# Altium schematic sheet LED_BUFFER_v1.SchDoc
size A1
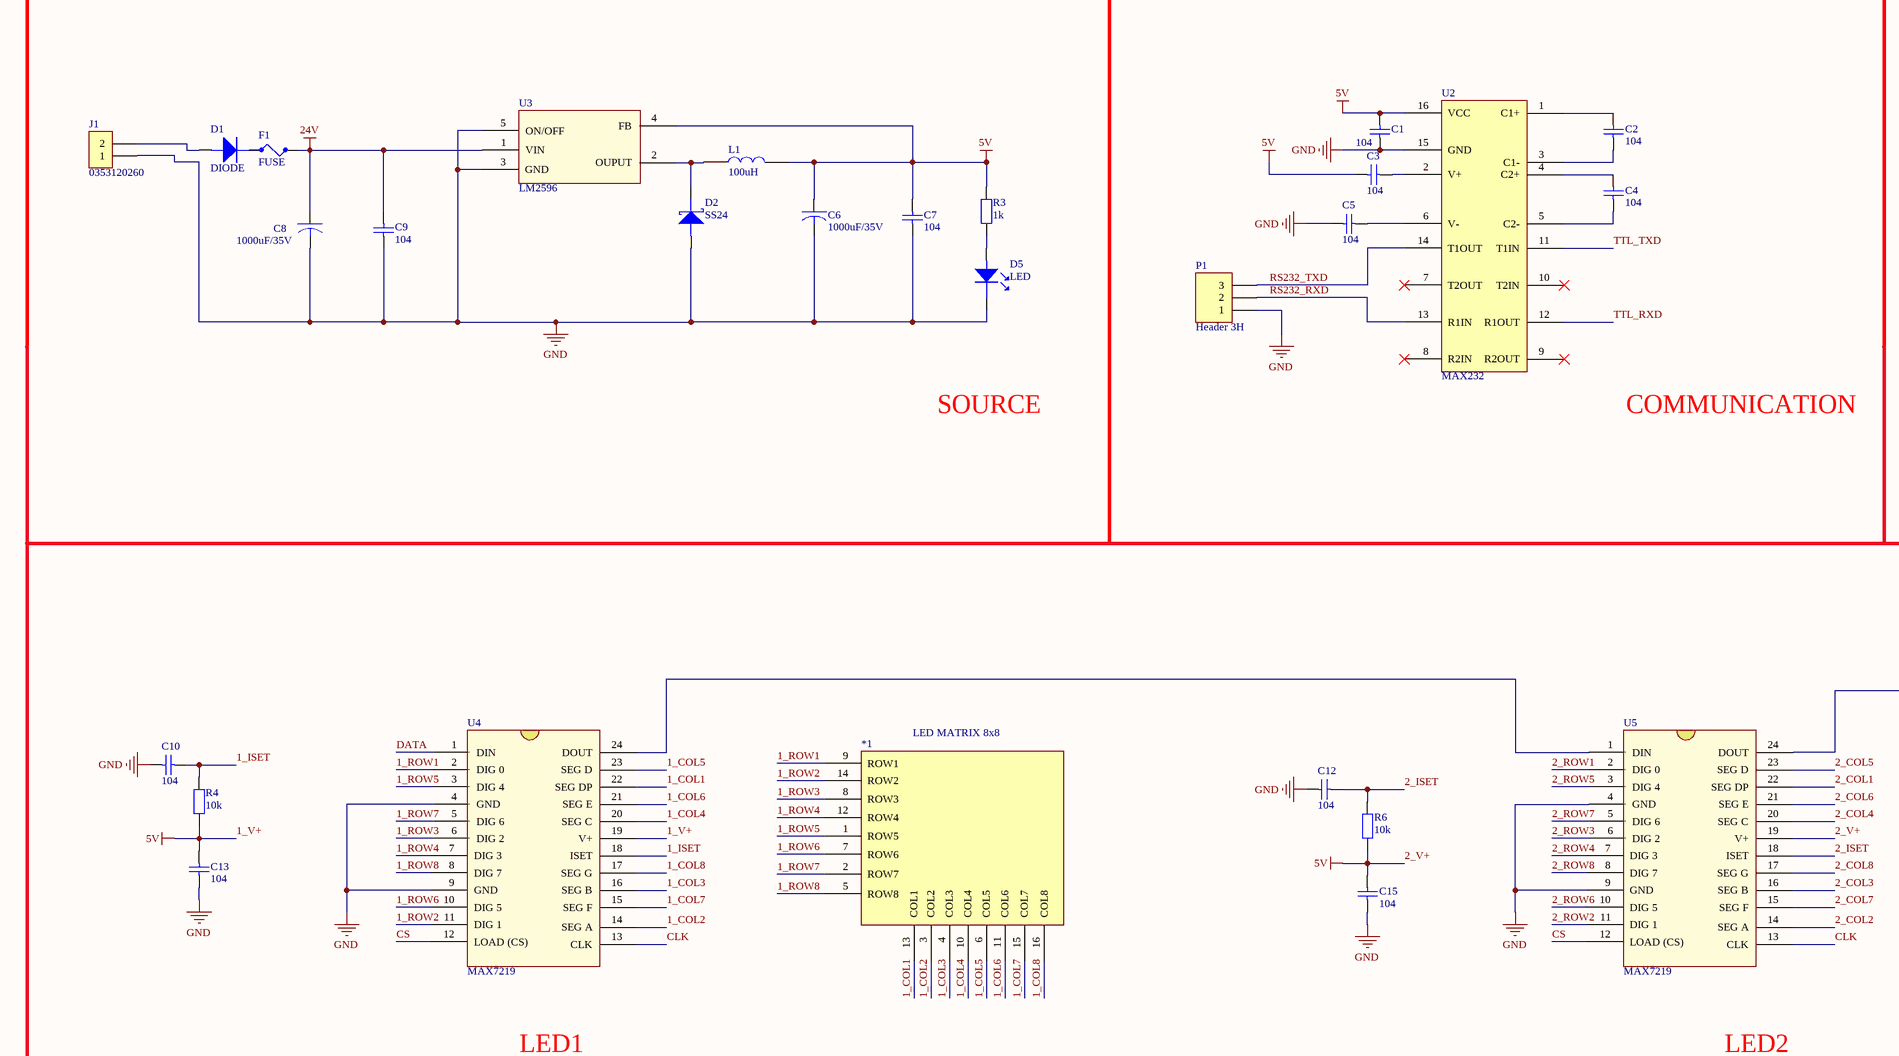
[diagram p0: LED_BUFFER_v1.SchDoc, top left]
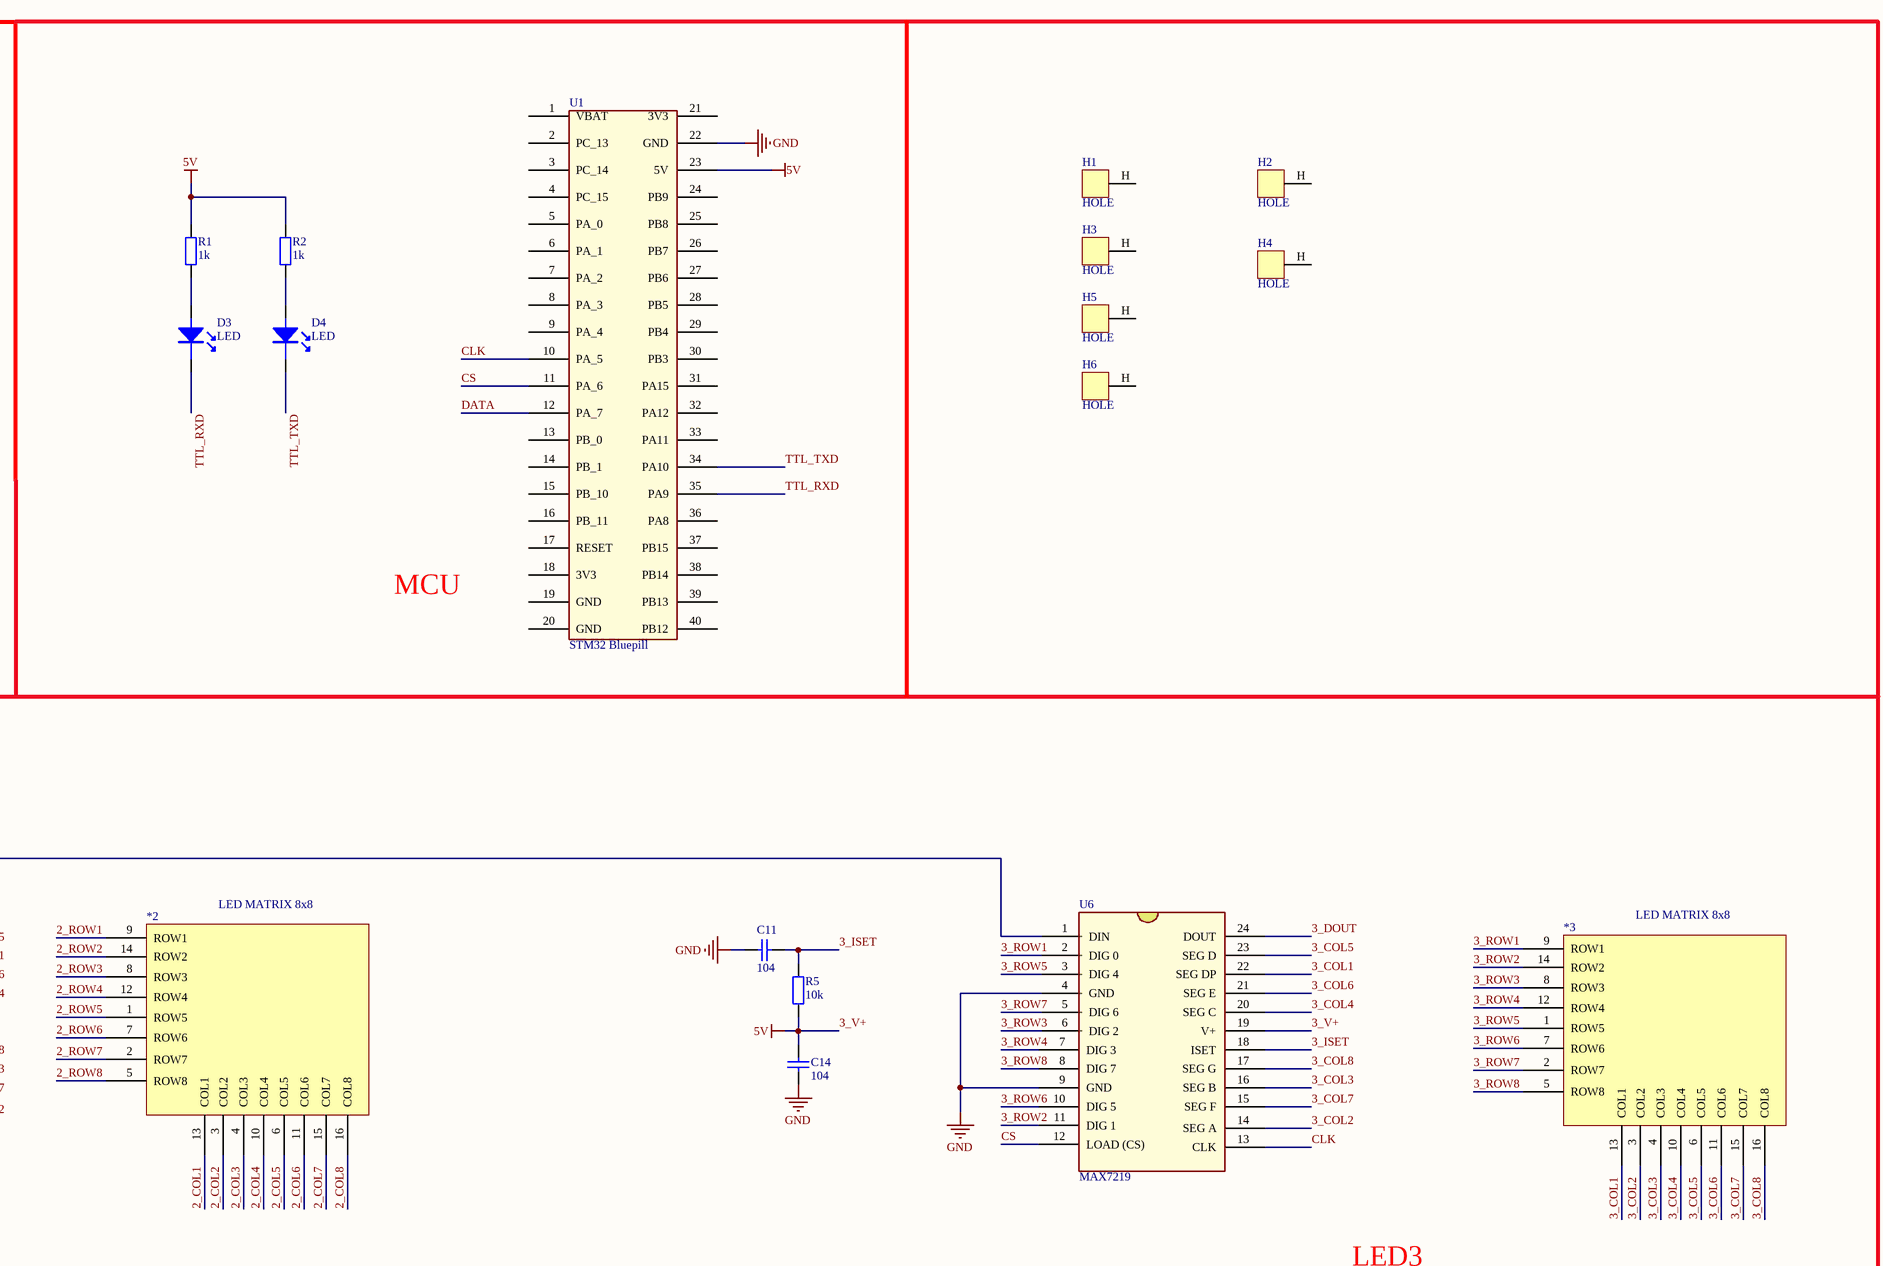
[diagram p1: LED_BUFFER_v1.SchDoc, top right]
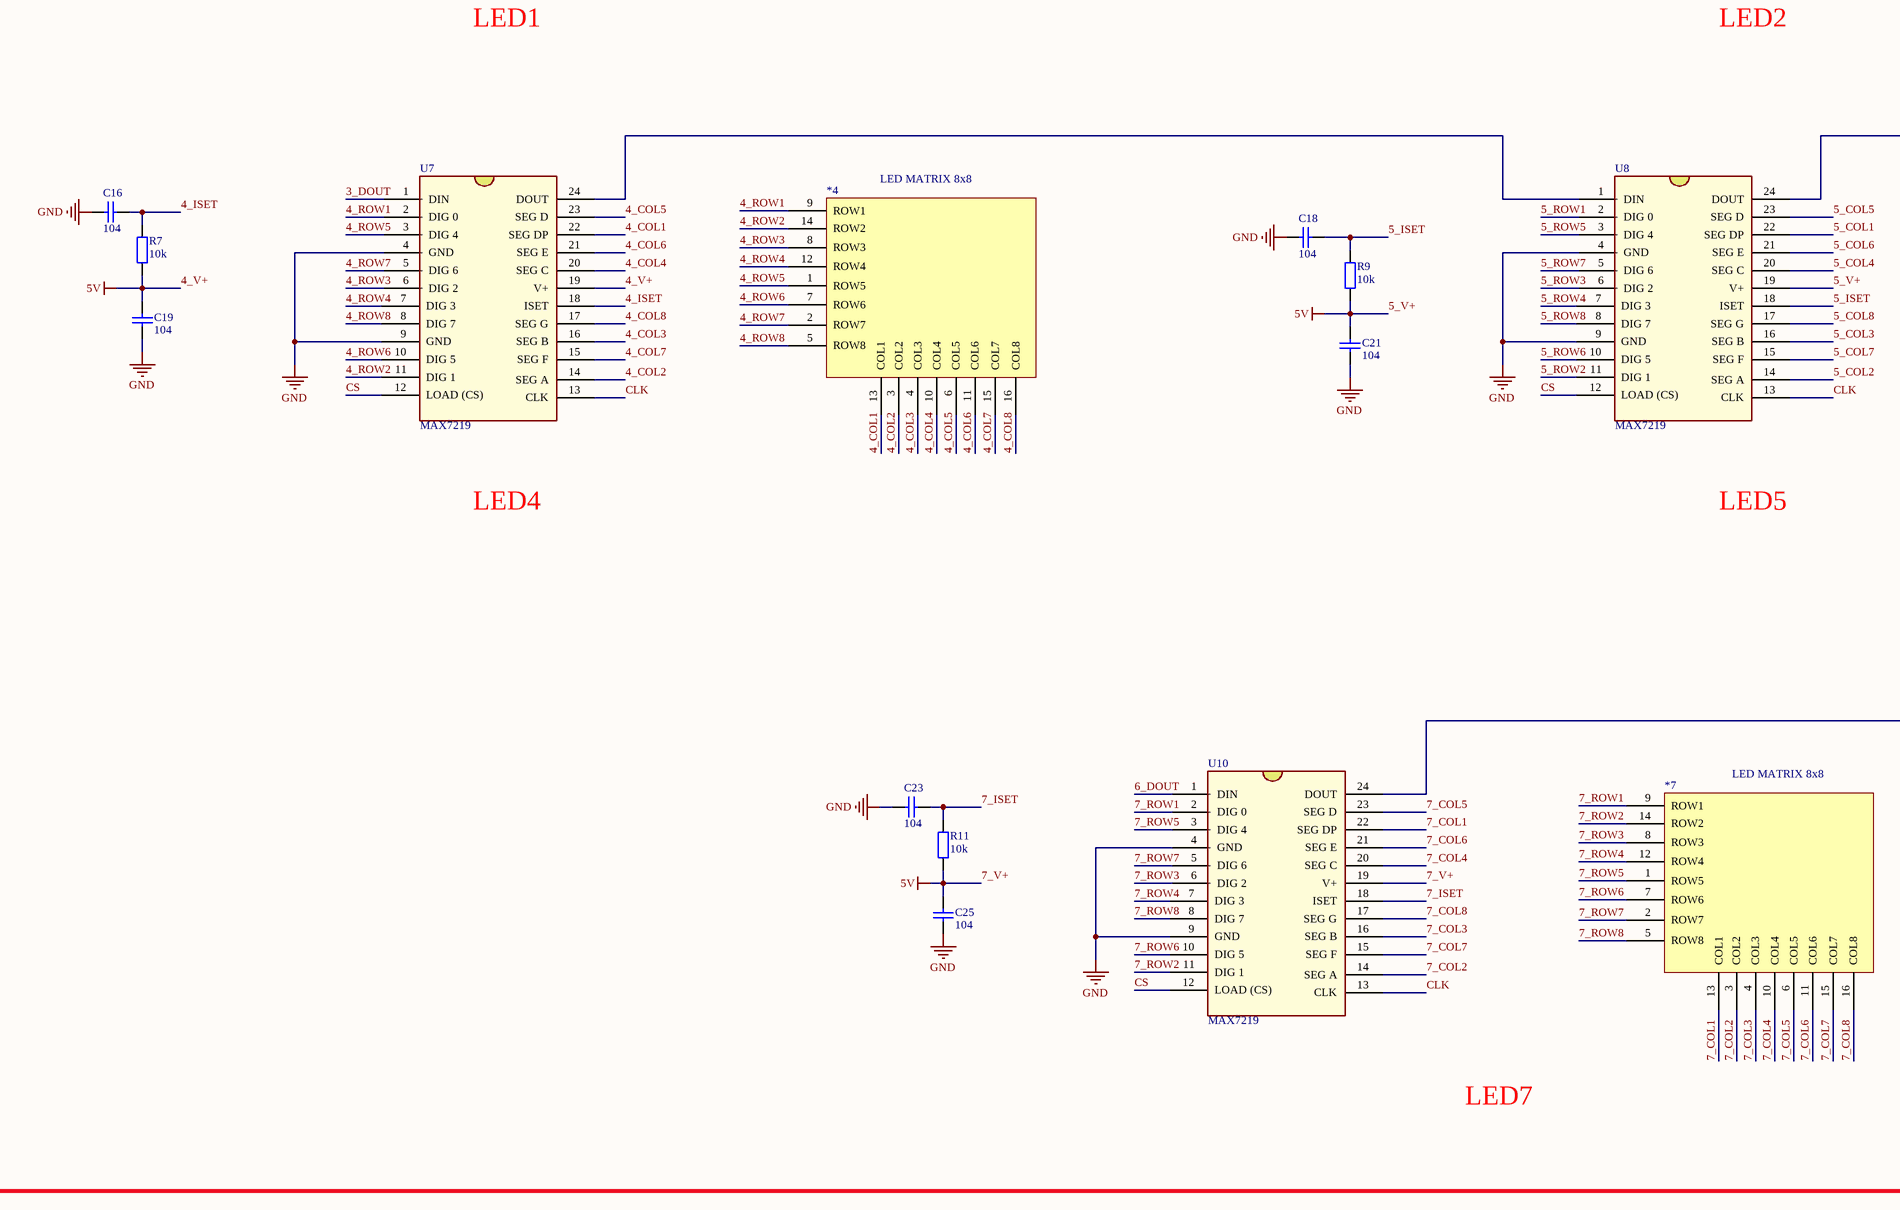
[diagram p2: LED_BUFFER_v1.SchDoc, bottom left]
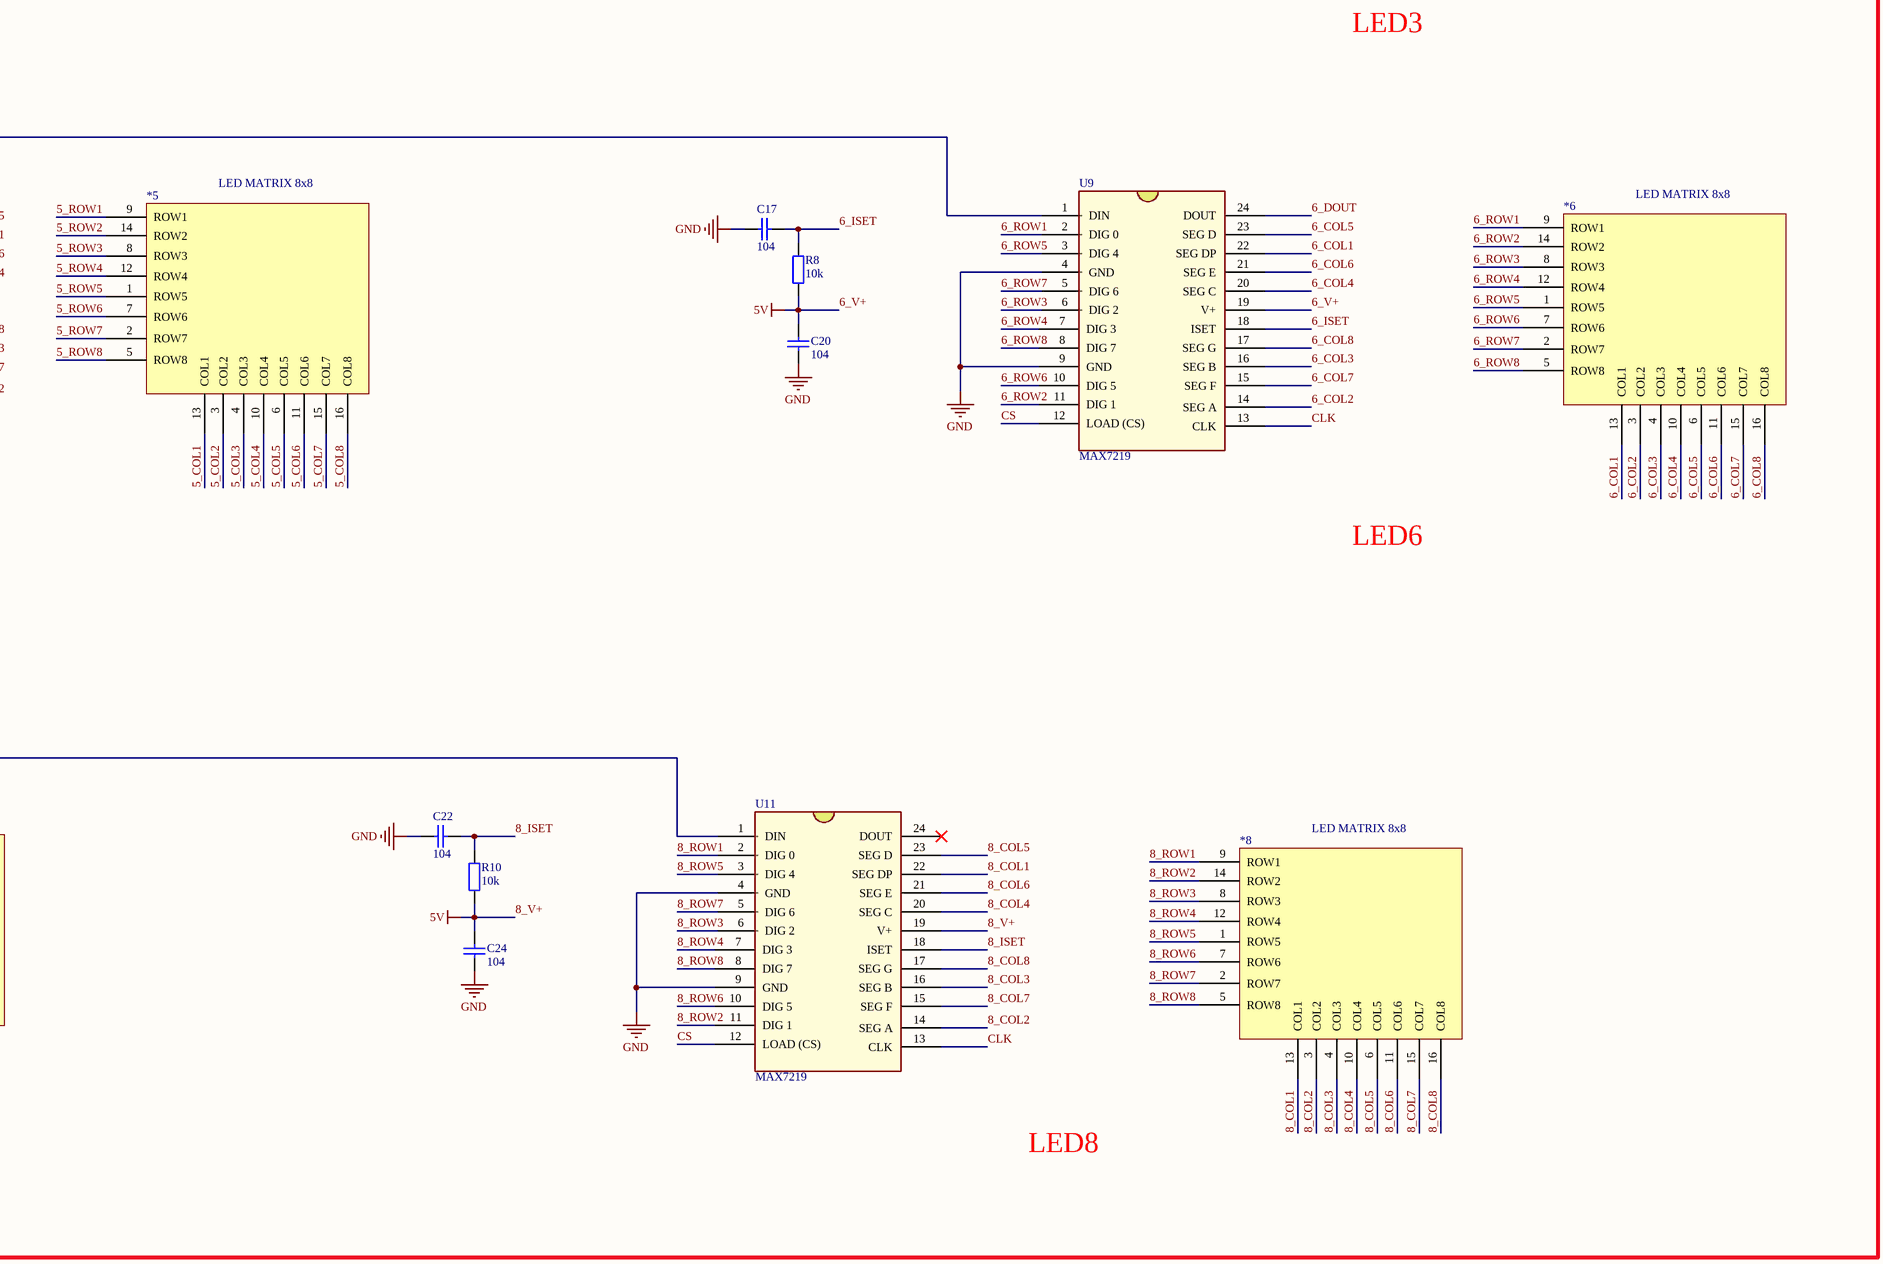
[diagram p3: LED_BUFFER_v1.SchDoc, bottom right]

## Parts
*1  LED MATRIX 8x8  [LED MATRIX 8x8]
*2  LED MATRIX 8x8  [LED MATRIX 8x8]
*3  LED MATRIX 8x8  [LED MATRIX 8x8]
*4  LED MATRIX 8x8  [LED MATRIX 8x8]
*5  LED MATRIX 8x8  [LED MATRIX 8x8]
*6  LED MATRIX 8x8  [LED MATRIX 8x8]
*7  LED MATRIX 8x8  [LED MATRIX 8x8]
*8  LED MATRIX 8x8  [LED MATRIX 8x8]
C1  104  [0805 CAP]
C2  104  [0805 CAP]
C3  104  [0805 CAP]
C4  104  [0805 CAP]
C5  104  [0805 CAP]
C6  1000uF/35V  [CAP ALUMINUM SMD]
C7  104  [0805 CAP]
C8  1000uF/35V  [CAP ALUMINUM SMD]
C9  104  [0805 CAP]
C10  104  [0805 CAP]
C11  104  [0805 CAP]
C12  104  [0805 CAP]
C13  104  [0805 CAP]
C14  104  [0805 CAP]
C15  104  [0805 CAP]
C16  104  [0805 CAP]
C17  104  [0805 CAP]
C18  104  [0805 CAP]
C19  104  [0805 CAP]
C20  104  [0805 CAP]
C21  104  [0805 CAP]
C22  104  [0805 CAP]
C23  104  [0805 CAP]
C24  104  [0805 CAP]
C25  104  [0805 CAP]
D1  DIODE  [DIODE SMA]
D2  SS24  [DIODE ZENER SMD]
D3  LED  [LED SMD 0805]
D4  LED  [LED SMD 0805]
D5  LED  [LED SMD 0805]
F1  FUSE  [FUSE 1812]
H1  HOLE  [HOLE]
H2  HOLE  [HOLE]
H3  HOLE  [HOLE]
H4  HOLE  [HOLE]
H5  HOLE  [HOLE]
H6  HOLE  [HOLE]
J1  CONN HEADER VERT 2POS 2.5MM  [0353120260]  (value not drawn)
L1  100uH  [CDRH127 - 3A]
P1  Header 3H  [HDR1X3 2mm]
R1  1k  [0805 RESISTOR]
R2  1k  [0805 RESISTOR]
R3  1k  [0805 RESISTOR]
R4  10k  [0805 RESISTOR]
R5  10k  [0805 RESISTOR]
R6  10k  [0805 RESISTOR]
R7  10k  [0805 RESISTOR]
R8  10k  [0805 RESISTOR]
R9  10k  [0805 RESISTOR]
R10  10k  [0805 RESISTOR]
R11  10k  [0805 RESISTOR]
U1  STM32 Bluepill  [Arduino STM32F103]
U2  MAX232  [SOIC 16PIN]
U3  LM2596  [TO263-5]
U4  MAX7219  [SOIC127P1030X265-24N]
U5  MAX7219  [SOIC127P1030X265-24N]
U6  MAX7219  [SOIC127P1030X265-24N]
U7  MAX7219  [SOIC127P1030X265-24N]
U8  MAX7219  [SOIC127P1030X265-24N]
U9  MAX7219  [SOIC127P1030X265-24N]
U10  MAX7219  [SOIC127P1030X265-24N]
U11  MAX7219  [SOIC127P1030X265-24N]

## Nets
1_V+: C1.2 C3.1 C6.1 C7.1 C13.1 C14.1 C15.1 C19.1 C20.1 C21.1 C24.1 C25.1 L1.2 R1.2 R2.2 R3.2 R4.1 R5.1 R6.1 R7.1 R8.1 R9.1 R10.1 R11.1 U1.23(5V) U2.16(VCC) U3.4(FB) U4.19(V+) U5.19(V+) U6.19(V+) U7.19(V+) U8.19(V+) U9.19(V+) U10.19(V+) U11.19(V+)  [also labelled 2_V+, 3_V+, 4_V+, 5_V+, 5V, 6_V+, 7_V+, 8_V+]
24V: C8.1 C9.1 F1.1 U3.1(VIN)
GND: C1.1 C5.1 C6.2 C7.2 C8.2 C9.2 C10.1 C11.1 C12.1 C13.2 C14.2 C15.2 C16.1 C17.1 C18.1 C19.2 C20.2 C21.2 C22.1 C23.1 C24.2 C25.2 D2.1(A) D5.2 J1.1 P1.1 U1.22(GND) U2.15(GND) U3.3(GND) U3.5(ON/OFF) U4.4(GND) U4.9(GND) U5.4(GND) U5.9(GND) U6.4(GND) U6.9(GND) U7.4(GND) U7.9(GND) U8.4(GND) U8.9(GND) U9.4(GND) U9.9(GND) U10.4(GND) U10.9(GND) U11.4(GND) U11.9(GND)
1_COL1: *1.13(COL1) U4.22(SEG_DP)
1_COL2: *1.3(COL2) U4.14(SEG_A)
1_COL3: *1.4(COL3) U4.16(SEG_B)
1_COL4: *1.10(COL4) U4.20(SEG_C)
1_COL5: *1.6(COL5) U4.23(SEG_D)
1_COL6: *1.11(COL6) U4.21(SEG_E)
1_COL7: *1.15(COL7) U4.15(SEG_F)
1_COL8: *1.16(COL8) U4.17(SEG_G)
1_ISET: C10.2 R4.2 U4.18(ISET)
1_ROW1: *1.9(ROW1) U4.2(DIG_0)
1_ROW2: *1.14(ROW2) U4.11(DIG_1)
1_ROW3: *1.8(ROW3) U4.6(DIG_2)
1_ROW4: *1.12(ROW4) U4.7(DIG_3)
1_ROW5: *1.1(ROW5) U4.3(DIG_4)
1_ROW6: *1.7(ROW6) U4.10(DIG_5)
1_ROW7: *1.2(ROW7) U4.5(DIG_6)
1_ROW8: *1.5(ROW8) U4.8(DIG_7)
2_COL1: *2.13(COL1) U5.22(SEG_DP)
2_COL2: *2.3(COL2) U5.14(SEG_A)
2_COL3: *2.4(COL3) U5.16(SEG_B)
2_COL4: *2.10(COL4) U5.20(SEG_C)
2_COL5: *2.6(COL5) U5.23(SEG_D)
2_COL6: *2.11(COL6) U5.21(SEG_E)
2_COL7: *2.15(COL7) U5.15(SEG_F)
2_COL8: *2.16(COL8) U5.17(SEG_G)
2_ISET: C12.2 R6.2 U5.18(ISET)
2_ROW1: *2.9(ROW1) U5.2(DIG_0)
2_ROW2: *2.14(ROW2) U5.11(DIG_1)
2_ROW3: *2.8(ROW3) U5.6(DIG_2)
2_ROW4: *2.12(ROW4) U5.7(DIG_3)
2_ROW5: *2.1(ROW5) U5.3(DIG_4)
2_ROW6: *2.7(ROW6) U5.10(DIG_5)
2_ROW7: *2.2(ROW7) U5.5(DIG_6)
2_ROW8: *2.5(ROW8) U5.8(DIG_7)
3_COL1: *3.13(COL1) U6.22(SEG_DP)
3_COL2: *3.3(COL2) U6.14(SEG_A)
3_COL3: *3.4(COL3) U6.16(SEG_B)
3_COL4: *3.10(COL4) U6.20(SEG_C)
3_COL5: *3.6(COL5) U6.23(SEG_D)
3_COL6: *3.11(COL6) U6.21(SEG_E)
3_COL7: *3.15(COL7) U6.15(SEG_F)
3_COL8: *3.16(COL8) U6.17(SEG_G)
3_DOUT: U6.24(DOUT) U7.1(DIN)
3_ISET: C11.2 R5.2 U6.18(ISET)
3_ROW1: *3.9(ROW1) U6.2(DIG_0)
3_ROW2: *3.14(ROW2) U6.11(DIG_1)
3_ROW3: *3.8(ROW3) U6.6(DIG_2)
3_ROW4: *3.12(ROW4) U6.7(DIG_3)
3_ROW5: *3.1(ROW5) U6.3(DIG_4)
3_ROW6: *3.7(ROW6) U6.10(DIG_5)
3_ROW7: *3.2(ROW7) U6.5(DIG_6)
3_ROW8: *3.5(ROW8) U6.8(DIG_7)
4_COL1: *4.13(COL1) U7.22(SEG_DP)
4_COL2: *4.3(COL2) U7.14(SEG_A)
4_COL3: *4.4(COL3) U7.16(SEG_B)
4_COL4: *4.10(COL4) U7.20(SEG_C)
4_COL5: *4.6(COL5) U7.23(SEG_D)
4_COL6: *4.11(COL6) U7.21(SEG_E)
4_COL7: *4.15(COL7) U7.15(SEG_F)
4_COL8: *4.16(COL8) U7.17(SEG_G)
4_ISET: C16.2 R7.2 U7.18(ISET)
4_ROW1: *4.9(ROW1) U7.2(DIG_0)
4_ROW2: *4.14(ROW2) U7.11(DIG_1)
4_ROW3: *4.8(ROW3) U7.6(DIG_2)
4_ROW4: *4.12(ROW4) U7.7(DIG_3)
4_ROW5: *4.1(ROW5) U7.3(DIG_4)
4_ROW6: *4.7(ROW6) U7.10(DIG_5)
4_ROW7: *4.2(ROW7) U7.5(DIG_6)
4_ROW8: *4.5(ROW8) U7.8(DIG_7)
5_COL1: *5.13(COL1) U8.22(SEG_DP)
5_COL2: *5.3(COL2) U8.14(SEG_A)
5_COL3: *5.4(COL3) U8.16(SEG_B)
5_COL4: *5.10(COL4) U8.20(SEG_C)
5_COL5: *5.6(COL5) U8.23(SEG_D)
5_COL6: *5.11(COL6) U8.21(SEG_E)
5_COL7: *5.15(COL7) U8.15(SEG_F)
5_COL8: *5.16(COL8) U8.17(SEG_G)
5_ISET: C18.2 R9.2 U8.18(ISET)
5_ROW1: *5.9(ROW1) U8.2(DIG_0)
5_ROW2: *5.14(ROW2) U8.11(DIG_1)
5_ROW3: *5.8(ROW3) U8.6(DIG_2)
5_ROW4: *5.12(ROW4) U8.7(DIG_3)
5_ROW5: *5.1(ROW5) U8.3(DIG_4)
5_ROW6: *5.7(ROW6) U8.10(DIG_5)
5_ROW7: *5.2(ROW7) U8.5(DIG_6)
5_ROW8: *5.5(ROW8) U8.8(DIG_7)
6_COL1: *6.13(COL1) U9.22(SEG_DP)
6_COL2: *6.3(COL2) U9.14(SEG_A)
6_COL3: *6.4(COL3) U9.16(SEG_B)
6_COL4: *6.10(COL4) U9.20(SEG_C)
6_COL5: *6.6(COL5) U9.23(SEG_D)
6_COL6: *6.11(COL6) U9.21(SEG_E)
6_COL7: *6.15(COL7) U9.15(SEG_F)
6_COL8: *6.16(COL8) U9.17(SEG_G)
6_DOUT: U9.24(DOUT) U10.1(DIN)
6_ISET: C17.2 R8.2 U9.18(ISET)
6_ROW1: *6.9(ROW1) U9.2(DIG_0)
6_ROW2: *6.14(ROW2) U9.11(DIG_1)
6_ROW3: *6.8(ROW3) U9.6(DIG_2)
6_ROW4: *6.12(ROW4) U9.7(DIG_3)
6_ROW5: *6.1(ROW5) U9.3(DIG_4)
6_ROW6: *6.7(ROW6) U9.10(DIG_5)
6_ROW7: *6.2(ROW7) U9.5(DIG_6)
6_ROW8: *6.5(ROW8) U9.8(DIG_7)
7_COL1: *7.13(COL1) U10.22(SEG_DP)
7_COL2: *7.3(COL2) U10.14(SEG_A)
7_COL3: *7.4(COL3) U10.16(SEG_B)
7_COL4: *7.10(COL4) U10.20(SEG_C)
7_COL5: *7.6(COL5) U10.23(SEG_D)
7_COL6: *7.11(COL6) U10.21(SEG_E)
7_COL7: *7.15(COL7) U10.15(SEG_F)
7_COL8: *7.16(COL8) U10.17(SEG_G)
7_ISET: C23.2 R11.2 U10.18(ISET)
7_ROW1: *7.9(ROW1) U10.2(DIG_0)
7_ROW2: *7.14(ROW2) U10.11(DIG_1)
7_ROW3: *7.8(ROW3) U10.6(DIG_2)
7_ROW4: *7.12(ROW4) U10.7(DIG_3)
7_ROW5: *7.1(ROW5) U10.3(DIG_4)
7_ROW6: *7.7(ROW6) U10.10(DIG_5)
7_ROW7: *7.2(ROW7) U10.5(DIG_6)
7_ROW8: *7.5(ROW8) U10.8(DIG_7)
8_COL1: *8.13(COL1) U11.22(SEG_DP)
8_COL2: *8.3(COL2) U11.14(SEG_A)
8_COL3: *8.4(COL3) U11.16(SEG_B)
8_COL4: *8.10(COL4) U11.20(SEG_C)
8_COL5: *8.6(COL5) U11.23(SEG_D)
8_COL6: *8.11(COL6) U11.21(SEG_E)
8_COL7: *8.15(COL7) U11.15(SEG_F)
8_COL8: *8.16(COL8) U11.17(SEG_G)
8_ISET: C22.2 R10.2 U11.18(ISET)
8_ROW1: *8.9(ROW1) U11.2(DIG_0)
8_ROW2: *8.14(ROW2) U11.11(DIG_1)
8_ROW3: *8.8(ROW3) U11.6(DIG_2)
8_ROW4: *8.12(ROW4) U11.7(DIG_3)
8_ROW5: *8.1(ROW5) U11.3(DIG_4)
8_ROW6: *8.7(ROW6) U11.10(DIG_5)
8_ROW7: *8.2(ROW7) U11.5(DIG_6)
8_ROW8: *8.5(ROW8) U11.8(DIG_7)
CLK: U1.10(PA_5) U4.13(CLK) U5.13(CLK) U6.13(CLK) U7.13(CLK) U8.13(CLK) U9.13(CLK) U10.13(CLK) U11.13(CLK)
CS: U1.11(PA_6) U4.12(LOAD_(CS)) U5.12(LOAD_(CS)) U6.12(LOAD_(CS)) U7.12(LOAD_(CS)) U8.12(LOAD_(CS)) U9.12(LOAD_(CS)) U10.12(LOAD_(CS)) U11.12(LOAD_(CS))
DATA: U1.12(PA_7) U4.1(DIN)
RS232_RXD: P1.2 U2.13(R1IN)
RS232_TXD: P1.3 U2.14(T1OUT)
TTL_RXD: D3.2 U1.35(PA9) U2.12(R1OUT)
TTL_TXD: D4.2 U1.34(PA10) U2.11(T1IN)
NetC2_1: C2.1 U2.3(C1-)
NetC2_2: C2.2 U2.1(C1+)
NetC3_2: C3.2 U2.2(V+)
NetC4_1: C4.1 U2.4(C2+)
NetC4_2: C4.2 U2.5(C2-)
NetC5_2: C5.2 U2.6(V-)
NetD1_1: D1.1 J1.2
NetD1_2: D1.2 F1.2
NetD2_2: D2.2(K) L1.1 U3.2(OUPUT)
NetD3_1: D3.1 R1.1
NetD4_1: D4.1 R2.1
NetD5_1: D5.1 R3.1
NetU4_24: U4.24(DOUT) U5.1(DIN)
NetU5_24: U5.24(DOUT) U6.1(DIN)
NetU7_24: U7.24(DOUT) U8.1(DIN)
NetU8_24: U8.24(DOUT) U9.1(DIN)
NetU10_24: U10.24(DOUT) U11.1(DIN)

Not connected (* = marked no-connect by the designer): H1 H(HOLE); H2 H(HOLE); H3 H(HOLE); H4 H(HOLE); H5 H(HOLE); H6 H(HOLE); U1 1(VBAT) 2(PC_13) 3(PC_14) 4(PC_15) 5(PA_0) 6(PA_1) 7(PA_2) 8(PA_3) 9(PA_4) 13(PB_0) 14(PB_1) 15(PB_10) 16(PB_11) 17(RESET) 18(3V3) 19(GND) 20(GND) 21(3V3) 24(PB9) 25(PB8) 26(PB7) 27(PB6) 28(PB5) 29(PB4) 30(PB3) 31(PA15) 32(PA12) 33(PA11) 36(PA8) 37(PB15) 38(PB14) 39(PB13) 40(PB12); U2 7(T2OUT)* 8(R2IN)* 9(R2OUT)* 10(T2IN)*; U11 24(DOUT)*

## Notes on the sheet
- SOURCE
- COMMUNICATION
- MCU
- LED1
- LED2
- LED3
- LED4
- LED5
- LED6
- LED7
- LED8

## Library data of the parts
C1-C5 C7 C9-C25 = CAP CERAMIC: Published: 8-Jun-2000; LatestRevisionDate: 17-Jul-2002; LatestRevisionNote: Re-released for DXP Platform.; PackageReference: RAD-0.3; Publisher: Altium Limited
C6 C8 = CAPACITOR
D2 = SS1x
L1 = INDUCTOR
R1-R11 = RESISTOR: Value: R1/4W - 1K
J1 = CONN HEADER VERT 2POS 2.5MM: P/N: 0353120260
P1 = Header 3H: LatestRevisionDate: 17-Jul-2002; LatestRevisionNote: Re-released for DXP Platform.; Publisher: Altium Limited